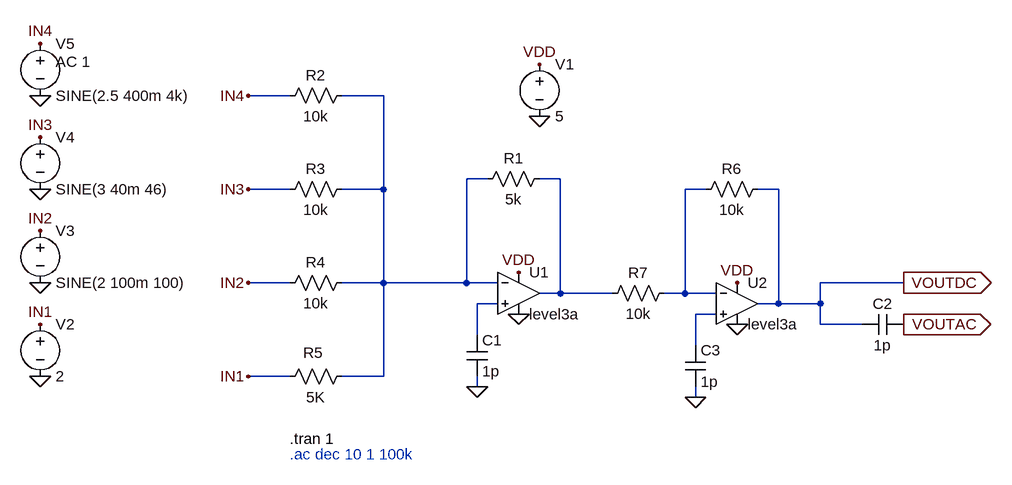
[diagram p0: schematic 4_IN_MIX.asc]
4_IN_MIX.asc, the LTspice schematic file:
Version 4
SHEET 1 1004 680
WIRE -96 -128 -160 -128
WIRE 48 -128 -16 -128
WIRE 208 0 176 0
WIRE 320 0 288 0
WIRE -96 16 -160 16
WIRE 48 16 48 -128
WIRE 48 16 -16 16
WIRE 544 16 512 16
WIRE 656 16 624 16
WIRE -96 160 -160 160
WIRE 48 160 48 16
WIRE 48 160 -16 160
WIRE 176 160 176 0
WIRE 176 160 48 160
WIRE 224 160 176 160
WIRE 848 160 720 160
WIRE 320 176 320 0
WIRE 320 176 288 176
WIRE 400 176 320 176
WIRE 512 176 512 16
WIRE 512 176 480 176
WIRE 560 176 512 176
WIRE 224 192 192 192
WIRE 656 192 656 16
WIRE 656 192 624 192
WIRE 720 192 720 160
WIRE 720 192 656 192
WIRE 560 208 528 208
WIRE 720 224 720 192
WIRE 784 224 720 224
WIRE 192 240 192 192
WIRE 528 256 528 208
WIRE -96 304 -160 304
WIRE 48 304 48 160
WIRE 48 304 -16 304
WIRE 192 320 192 304
WIRE 528 336 528 320
FLAG 256 208 0
FLAG 256 144 VDD
FLAG 288 -96 0
FLAG 288 -176 VDD
FLAG 192 320 0
FLAG -480 304 0
FLAG -480 224 IN1
FLAG -480 160 0
FLAG -480 80 IN2
FLAG -480 16 0
FLAG -480 -64 IN3
FLAG -480 -128 0
FLAG -480 -208 IN4
FLAG -160 304 IN1
FLAG -160 160 IN2
FLAG -160 16 IN3
FLAG -160 -128 IN4
FLAG 848 224 VOUTAC
IOPIN 848 224 Out
FLAG 848 160 VOUTDC
IOPIN 848 160 Out
FLAG 592 224 0
FLAG 592 160 VDD
FLAG 528 336 0
SYMBOL OpAmps\\UniversalOpAmp3 256 176 R0
SYMATTR InstName U1
SYMBOL voltage 288 -192 R0
WINDOW 123 0 0 Left 0
WINDOW 39 0 0 Left 0
SYMATTR InstName V1
SYMATTR Value 5
SYMBOL res 304 -16 R90
WINDOW 0 0 56 VBottom 2
WINDOW 3 32 56 VTop 2
SYMATTR InstName R1
SYMATTR Value 5k
SYMBOL res 0 -144 R90
WINDOW 0 0 56 VBottom 2
WINDOW 3 32 56 VTop 2
SYMATTR InstName R2
SYMATTR Value 10k
SYMBOL res 0 0 R90
WINDOW 0 0 56 VBottom 2
WINDOW 3 32 56 VTop 2
SYMATTR InstName R3
SYMATTR Value 10k
SYMBOL res 0 144 R90
WINDOW 0 0 56 VBottom 2
WINDOW 3 32 56 VTop 2
SYMATTR InstName R4
SYMATTR Value 10k
SYMBOL res 0 288 R90
WINDOW 0 -5 60 VBottom 2
WINDOW 3 32 56 VTop 2
SYMATTR InstName R5
SYMATTR Value 5K
SYMBOL voltage -480 208 R0
WINDOW 123 0 0 Left 0
WINDOW 39 0 0 Left 0
SYMATTR InstName V2
SYMATTR Value 2
SYMBOL voltage -480 64 R0
WINDOW 123 0 0 Left 0
WINDOW 39 0 0 Left 0
SYMATTR InstName V3
SYMATTR Value SINE(2 100m 100)
SYMBOL voltage -480 -80 R0
WINDOW 123 0 0 Left 0
WINDOW 39 0 0 Left 0
SYMATTR InstName V4
SYMATTR Value SINE(3 40m 46)
SYMBOL voltage -480 -224 R0
WINDOW 123 24 44 Left 2
WINDOW 39 0 0 Left 0
SYMATTR Value2 AC 1
SYMATTR InstName V5
SYMATTR Value SINE(2.5 400m 4k)
SYMBOL cap 176 240 R0
SYMATTR InstName C1
SYMATTR Value 1p
SYMBOL cap 848 208 R90
WINDOW 0 0 32 VBottom 2
WINDOW 3 32 32 VTop 2
SYMATTR InstName C2
SYMATTR Value 1p
SYMBOL OpAmps\\UniversalOpAmp3 592 192 R0
SYMATTR InstName U2
SYMBOL res 640 0 R90
WINDOW 0 0 56 VBottom 2
WINDOW 3 32 56 VTop 2
SYMATTR InstName R6
SYMATTR Value 10k
SYMBOL cap 512 256 R0
SYMATTR InstName C3
SYMATTR Value 1p
SYMBOL res 496 160 R90
WINDOW 0 0 56 VBottom 2
WINDOW 3 32 56 VTop 2
SYMATTR InstName R7
SYMATTR Value 10k
TEXT -96 400 Left 2 !.tran 1
TEXT -96 424 Left 2 ;.ac dec 10 1 100k

The netlist it stands for:
* 4_IN_MIX.asc
XU1 N004 N001 VDD 0 N002 level3a  ; pins In+ In- V+ V- OUT
V1 VDD 0 5
R1 N002 N001 5k
R2 N001 IN4 10k
R3 N001 IN3 10k
R4 N001 IN2 10k
R5 N001 IN1 5K
V2 IN1 0 2
V3 IN2 0 SINE(2 100m 100)
V4 IN3 0 SINE(3 40m 46)
V5 IN4 0 SINE(2.5 400m 4k) AC 1
C1 N004 0 1p
C2 VOUTAC VOUTDC 1p
XU2 N005 N003 VDD 0 VOUTDC level3a  ; pins In+ In- V+ V- OUT
R6 VOUTDC N003 10k
C3 N005 0 1p
R7 N003 N002 10k
.tran 1
* .ac dec 10 1 100k
.backanno
.end